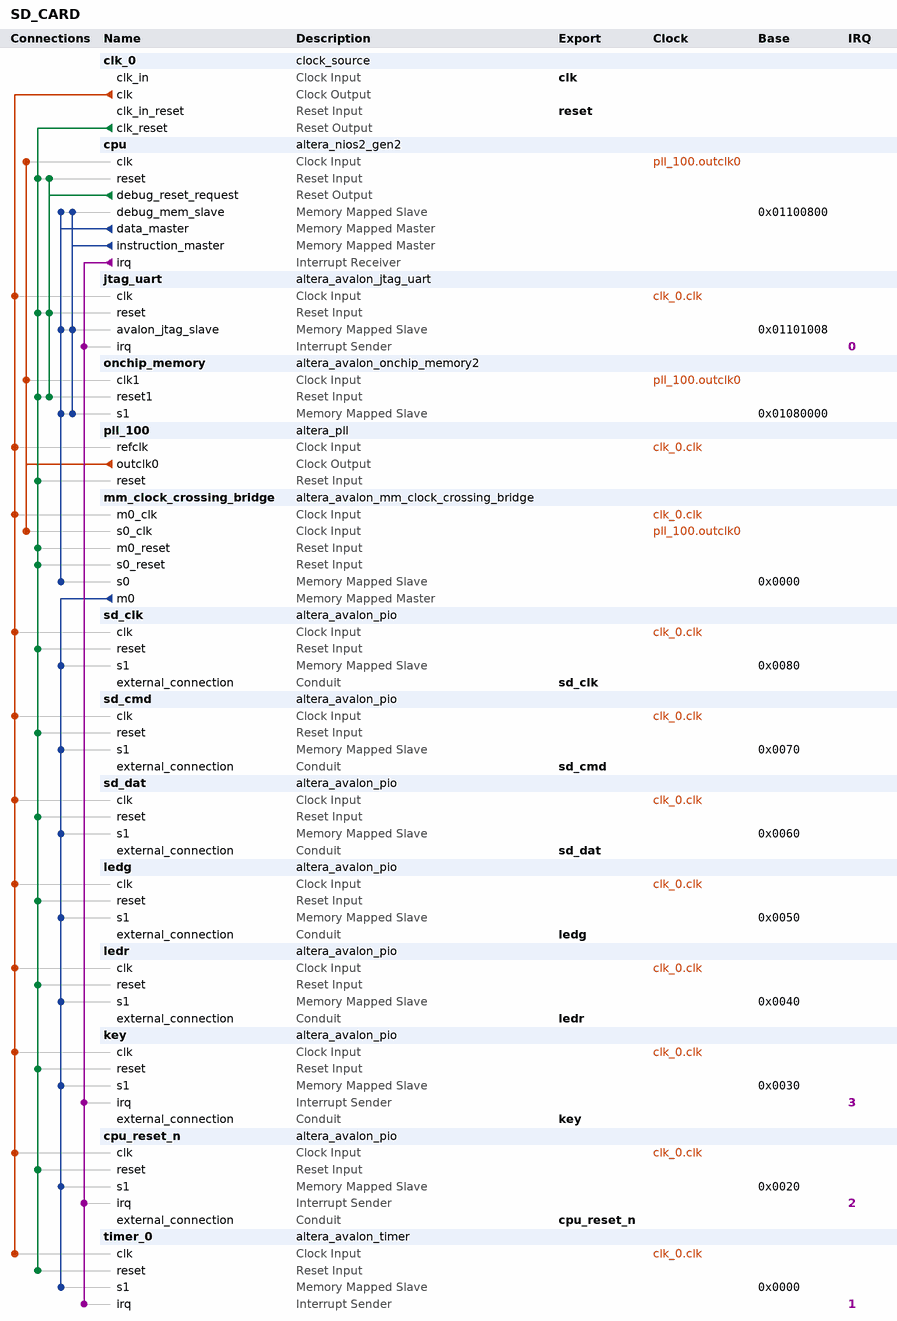
[diagram p0: system contents]
# Platform Designer (Qsys) system SD_CARD, Cyclone V 5CGXFC5C6F27C7
# Parameters at their usual value, and those the tool derives, are not listed.
package require -exact qsys 23.1
create_system SD_CARD
set_project_property DEVICE_FAMILY {Cyclone V}
set_project_property DEVICE 5CGXFC5C6F27C7

add_instance clk_0 clock_source 23.1
set_instance_parameter_value clk_0 clockFrequency 50000000

add_instance cpu altera_nios2_gen2 23.1
set_instance_parameter_value cpu dcache_size 2048
set_instance_parameter_value cpu exceptionSlave onchip_memory.s1
set_instance_parameter_value cpu icache_size 4096
set_instance_parameter_value cpu impl Tiny
set_instance_parameter_value cpu resetSlave onchip_memory.s1
set_instance_parameter_value cpu setting_activateTrace true

add_instance jtag_uart altera_avalon_jtag_uart 23.1
set_instance_parameter_value jtag_uart simInteractiveOptions NO_INTERACTIVE_WINDOWS

add_instance onchip_memory altera_avalon_onchip_memory2 23.1
set_instance_parameter_value onchip_memory dataWidth 32
set_instance_parameter_value onchip_memory dualPort false
set_instance_parameter_value onchip_memory initMemContent true
set_instance_parameter_value onchip_memory initializationFileName onchip_mem.hex
set_instance_parameter_value onchip_memory memorySize 300000

add_instance pll_100 altera_pll 23.1
set_instance_parameter_value pll_100 gui_device_speed_grade 1
set_instance_parameter_value pll_100 gui_number_of_clocks 1
set_instance_parameter_value pll_100 gui_operation_mode normal
set_instance_parameter_value pll_100 gui_output_clock_frequency0 100.0
set_instance_parameter_value pll_100 gui_pll_mode {Integer-N PLL}
set_instance_parameter_value pll_100 gui_reference_clock_frequency 50.0
set_instance_parameter_value pll_100 gui_use_locked false

add_instance mm_clock_crossing_bridge altera_avalon_mm_clock_crossing_bridge 23.1
set_instance_parameter_value mm_clock_crossing_bridge ADDRESS_WIDTH 12
set_instance_parameter_value mm_clock_crossing_bridge COMMAND_FIFO_DEPTH 4
set_instance_parameter_value mm_clock_crossing_bridge DATA_WIDTH 32
set_instance_parameter_value mm_clock_crossing_bridge MASTER_SYNC_DEPTH 2
set_instance_parameter_value mm_clock_crossing_bridge MAX_BURST_SIZE 1
set_instance_parameter_value mm_clock_crossing_bridge RESPONSE_FIFO_DEPTH 4
set_instance_parameter_value mm_clock_crossing_bridge SLAVE_SYNC_DEPTH 2
set_instance_parameter_value mm_clock_crossing_bridge USE_AUTO_ADDRESS_WIDTH 0

add_instance sd_clk altera_avalon_pio 23.1
set_instance_parameter_value sd_clk direction Output
set_instance_parameter_value sd_clk width 1

add_instance sd_cmd altera_avalon_pio 23.1
set_instance_parameter_value sd_cmd direction Bidir
set_instance_parameter_value sd_cmd width 1

add_instance sd_dat altera_avalon_pio 23.1
set_instance_parameter_value sd_dat direction Bidir
set_instance_parameter_value sd_dat width 4

add_instance ledg altera_avalon_pio 23.1
set_instance_parameter_value ledg direction Output
set_instance_parameter_value ledg width 8

add_instance ledr altera_avalon_pio 23.1
set_instance_parameter_value ledr direction Output
set_instance_parameter_value ledr width 10

add_instance key altera_avalon_pio 23.1
set_instance_parameter_value key captureEdge true
set_instance_parameter_value key direction Input
set_instance_parameter_value key edgeType ANY
set_instance_parameter_value key generateIRQ true
set_instance_parameter_value key irqType EDGE
set_instance_parameter_value key width 4

add_instance cpu_reset_n altera_avalon_pio 23.1
set_instance_parameter_value cpu_reset_n captureEdge true
set_instance_parameter_value cpu_reset_n direction Input
set_instance_parameter_value cpu_reset_n edgeType ANY
set_instance_parameter_value cpu_reset_n generateIRQ true
set_instance_parameter_value cpu_reset_n irqType EDGE
set_instance_parameter_value cpu_reset_n width 1

add_instance timer_0 altera_avalon_timer 23.1
set_instance_parameter_value timer_0 period 1
set_instance_parameter_value timer_0 periodUnits MSEC

# connections
add_connection clk_0.clk cpu_reset_n.clk clock
add_connection clk_0.clk jtag_uart.clk clock
add_connection clk_0.clk key.clk clock
add_connection clk_0.clk ledg.clk clock
add_connection clk_0.clk ledr.clk clock
add_connection clk_0.clk mm_clock_crossing_bridge.m0_clk clock
add_connection clk_0.clk pll_100.refclk clock
add_connection clk_0.clk sd_clk.clk clock
add_connection clk_0.clk sd_cmd.clk clock
add_connection clk_0.clk sd_dat.clk clock
add_connection clk_0.clk timer_0.clk clock
add_connection pll_100.outclk0 cpu.clk clock
add_connection pll_100.outclk0 mm_clock_crossing_bridge.s0_clk clock
add_connection pll_100.outclk0 onchip_memory.clk1 clock
add_connection clk_0.clk_reset cpu.reset reset
add_connection clk_0.clk_reset cpu_reset_n.reset reset
add_connection clk_0.clk_reset jtag_uart.reset reset
add_connection clk_0.clk_reset key.reset reset
add_connection clk_0.clk_reset ledg.reset reset
add_connection clk_0.clk_reset ledr.reset reset
add_connection clk_0.clk_reset mm_clock_crossing_bridge.m0_reset reset
add_connection clk_0.clk_reset mm_clock_crossing_bridge.s0_reset reset
add_connection clk_0.clk_reset onchip_memory.reset1 reset
add_connection clk_0.clk_reset pll_100.reset reset
add_connection clk_0.clk_reset sd_clk.reset reset
add_connection clk_0.clk_reset sd_cmd.reset reset
add_connection clk_0.clk_reset sd_dat.reset reset
add_connection clk_0.clk_reset timer_0.reset reset
add_connection cpu.debug_reset_request cpu.reset reset
add_connection cpu.debug_reset_request jtag_uart.reset reset
add_connection cpu.debug_reset_request onchip_memory.reset1 reset
add_connection cpu.data_master cpu.debug_mem_slave avalon
set_connection_parameter_value cpu.data_master/cpu.debug_mem_slave baseAddress 0x01100800
add_connection cpu.data_master jtag_uart.avalon_jtag_slave avalon
set_connection_parameter_value cpu.data_master/jtag_uart.avalon_jtag_slave baseAddress 0x01101008
add_connection cpu.data_master mm_clock_crossing_bridge.s0 avalon
set_connection_parameter_value cpu.data_master/mm_clock_crossing_bridge.s0 baseAddress 0x0000
add_connection cpu.data_master onchip_memory.s1 avalon
set_connection_parameter_value cpu.data_master/onchip_memory.s1 baseAddress 0x01080000
add_connection cpu.instruction_master cpu.debug_mem_slave avalon
set_connection_parameter_value cpu.instruction_master/cpu.debug_mem_slave baseAddress 0x01100800
add_connection cpu.instruction_master jtag_uart.avalon_jtag_slave avalon
set_connection_parameter_value cpu.instruction_master/jtag_uart.avalon_jtag_slave baseAddress 0x01101008
add_connection cpu.instruction_master onchip_memory.s1 avalon
set_connection_parameter_value cpu.instruction_master/onchip_memory.s1 baseAddress 0x01080000
add_connection mm_clock_crossing_bridge.m0 cpu_reset_n.s1 avalon
set_connection_parameter_value mm_clock_crossing_bridge.m0/cpu_reset_n.s1 baseAddress 0x0020
add_connection mm_clock_crossing_bridge.m0 key.s1 avalon
set_connection_parameter_value mm_clock_crossing_bridge.m0/key.s1 baseAddress 0x0030
add_connection mm_clock_crossing_bridge.m0 ledg.s1 avalon
set_connection_parameter_value mm_clock_crossing_bridge.m0/ledg.s1 baseAddress 0x0050
add_connection mm_clock_crossing_bridge.m0 ledr.s1 avalon
set_connection_parameter_value mm_clock_crossing_bridge.m0/ledr.s1 baseAddress 0x0040
add_connection mm_clock_crossing_bridge.m0 sd_clk.s1 avalon
set_connection_parameter_value mm_clock_crossing_bridge.m0/sd_clk.s1 baseAddress 0x0080
add_connection mm_clock_crossing_bridge.m0 sd_cmd.s1 avalon
set_connection_parameter_value mm_clock_crossing_bridge.m0/sd_cmd.s1 baseAddress 0x0070
add_connection mm_clock_crossing_bridge.m0 sd_dat.s1 avalon
set_connection_parameter_value mm_clock_crossing_bridge.m0/sd_dat.s1 baseAddress 0x0060
add_connection mm_clock_crossing_bridge.m0 timer_0.s1 avalon
set_connection_parameter_value mm_clock_crossing_bridge.m0/timer_0.s1 baseAddress 0x0000
add_connection cpu.irq cpu_reset_n.irq interrupt
set_connection_parameter_value cpu.irq/cpu_reset_n.irq irqNumber 2
add_connection cpu.irq jtag_uart.irq interrupt
set_connection_parameter_value cpu.irq/jtag_uart.irq irqNumber 0
add_connection cpu.irq key.irq interrupt
set_connection_parameter_value cpu.irq/key.irq irqNumber 3
add_connection cpu.irq timer_0.irq interrupt
set_connection_parameter_value cpu.irq/timer_0.irq irqNumber 1

# exported interfaces
add_interface clk clock sink
set_interface_property clk EXPORT_OF clk_0.clk_in
add_interface cpu_reset_n conduit end
set_interface_property cpu_reset_n EXPORT_OF cpu_reset_n.external_connection
add_interface key conduit end
set_interface_property key EXPORT_OF key.external_connection
add_interface ledg conduit end
set_interface_property ledg EXPORT_OF ledg.external_connection
add_interface ledr conduit end
set_interface_property ledr EXPORT_OF ledr.external_connection
add_interface reset reset sink
set_interface_property reset EXPORT_OF clk_0.clk_in_reset
add_interface sd_clk conduit end
set_interface_property sd_clk EXPORT_OF sd_clk.external_connection
add_interface sd_cmd conduit end
set_interface_property sd_cmd EXPORT_OF sd_cmd.external_connection
add_interface sd_dat conduit end
set_interface_property sd_dat EXPORT_OF sd_dat.external_connection

set_interconnect_requirement {$system} qsys_mm.clockCrossingAdapter HANDSHAKE
set_interconnect_requirement {$system} qsys_mm.enableEccProtection FALSE
set_interconnect_requirement {$system} qsys_mm.insertDefaultSlave FALSE
set_interconnect_requirement {$system} qsys_mm.maxAdditionalLatency 1

save_system SD_CARD.qsys
